# Altium schematic sheet Controller.SchDoc: Controller
size A3; Date: 11.10.2015; DocumentNumber: 2; Revision: 11; SheetNumber: 2; SheetTotal: 5
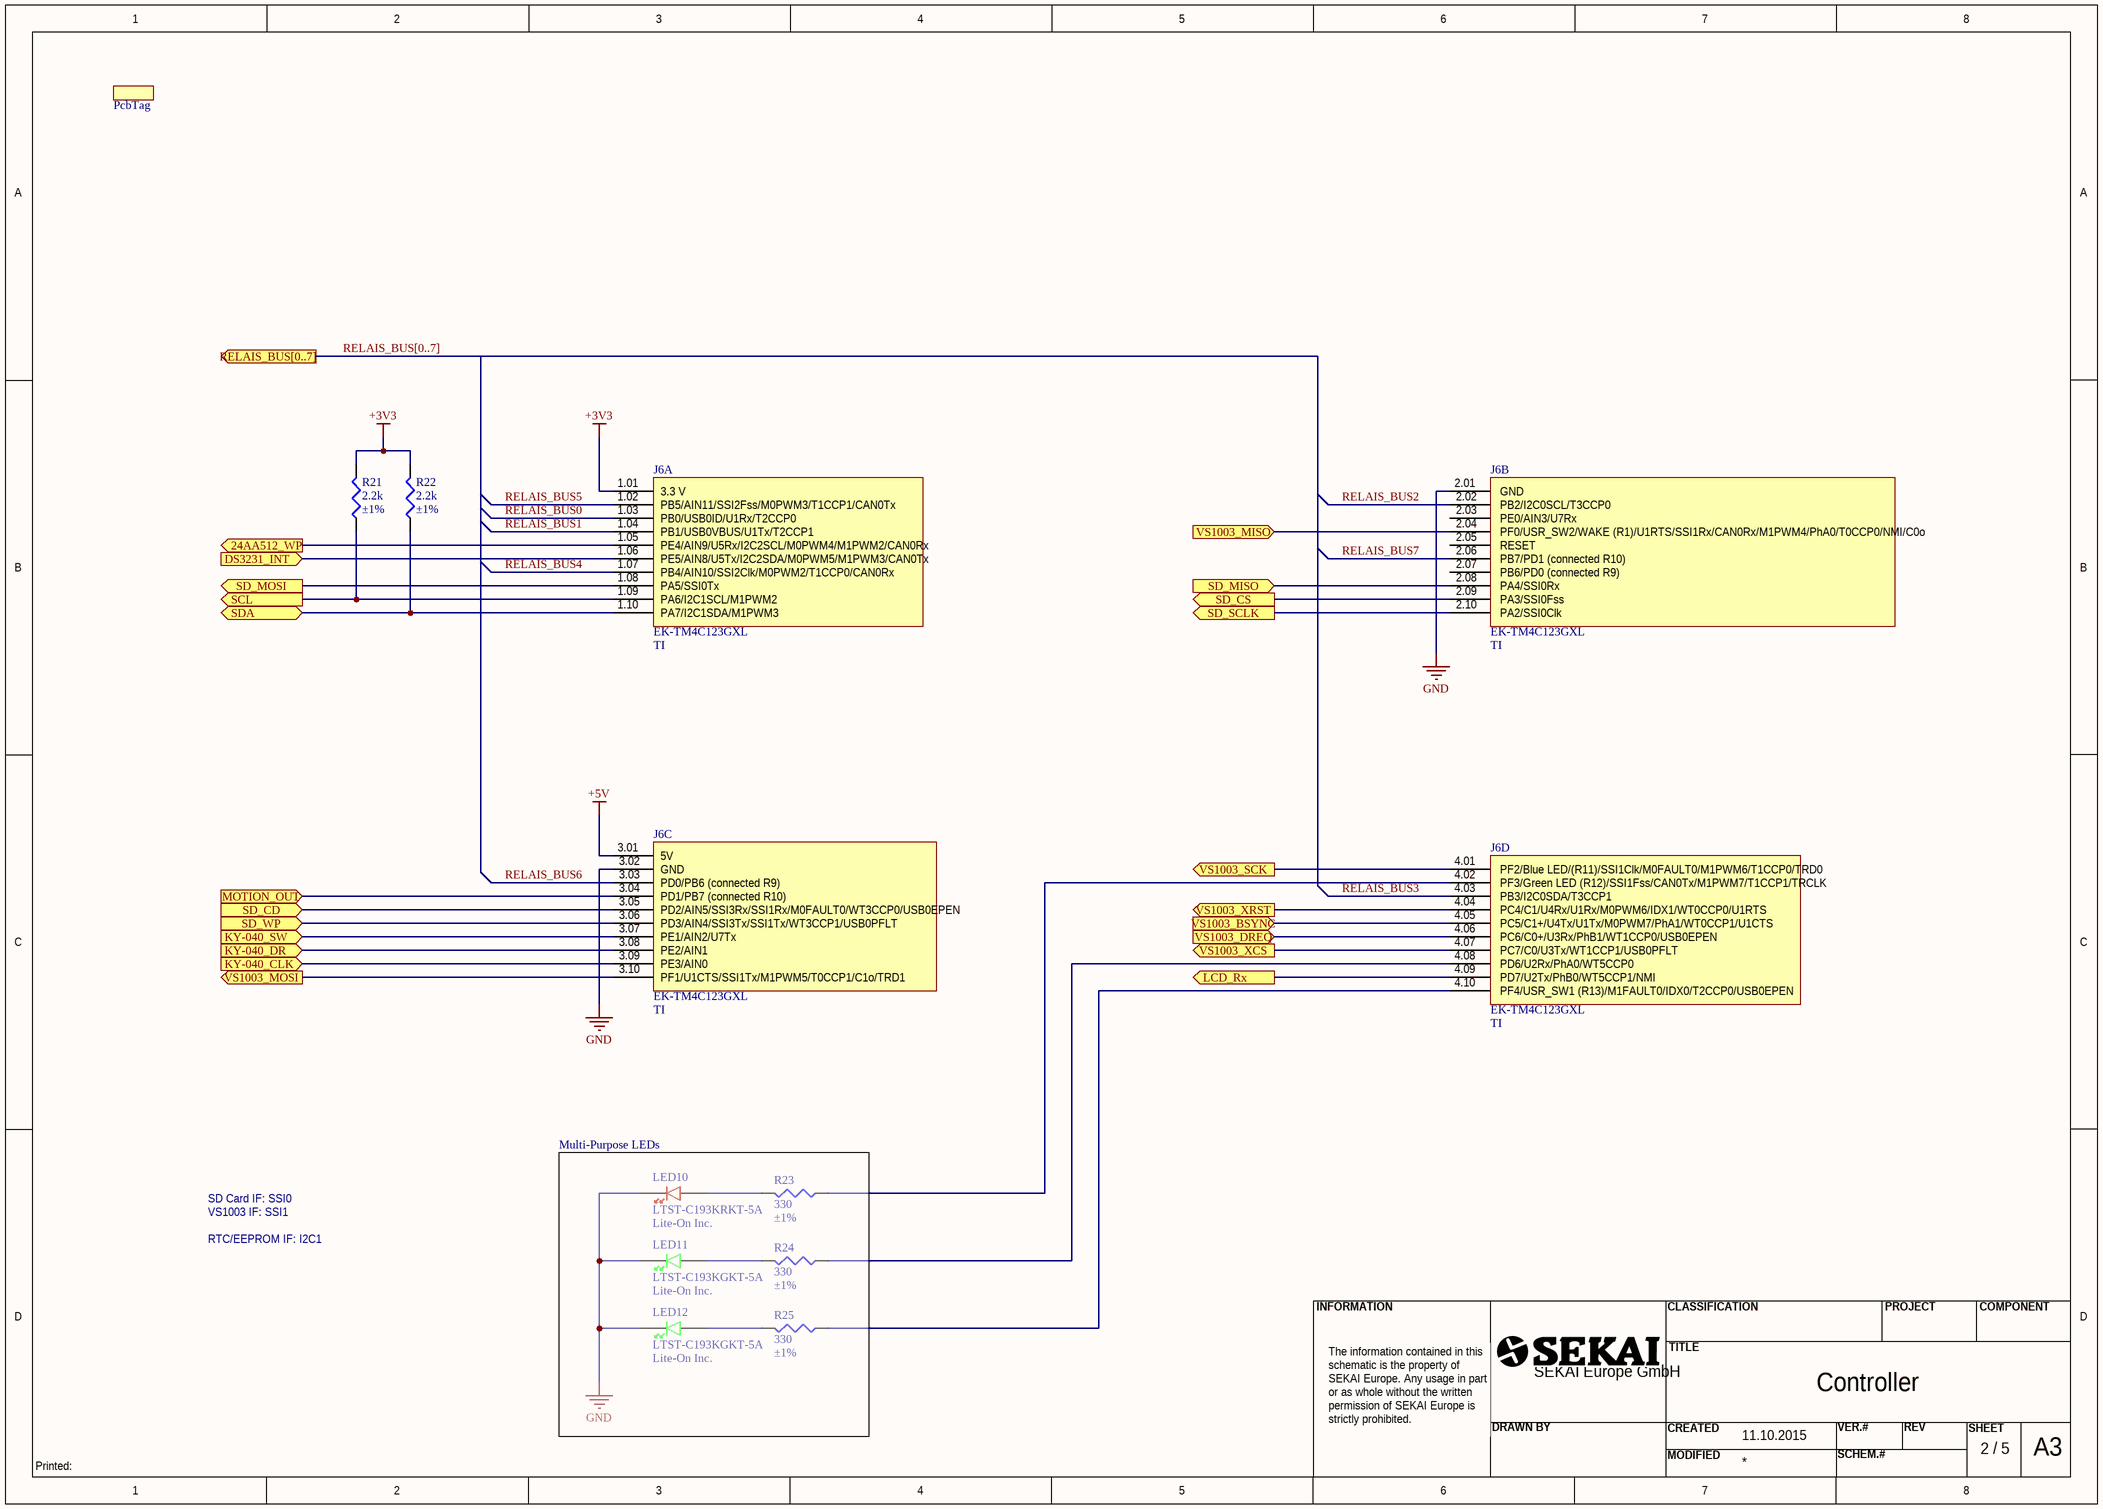
[diagram p0: Controller.SchDoc]

## Parts
?  PcbTag  [PcbTag]
J6  EK-TM4C123GXL  Manufacturer: TI  [EK-TM4C123GXL]  (parts A,B,C,D of 4)
LED10  LTST-C193KRKT-5A  Manufacturer: Lite-On Inc.  [LED0603-RED]
LED11  LTST-C193KGKT-5A  Manufacturer: Lite-On Inc.  [LED0603-GREEN]
LED12  LTST-C193KGKT-5A  Manufacturer: Lite-On Inc.  [LED0603-GREEN]
R21  Resistance (Ohms): 2.2k  Tolerance: ±1%  [R0603]  (hidden comment: ERJ-3EKF2201V)
R22  Resistance (Ohms): 2.2k  Tolerance: ±1%  [R0603]  (hidden comment: ERJ-3EKF2201V)
R23  Resistance (Ohms): 330  Tolerance: ±1%  [R0603]  (hidden comment: ERJ-3EKF3300V)
R24  Resistance (Ohms): 330  Tolerance: ±1%  [R0603]  (hidden comment: ERJ-3EKF3300V)
R25  Resistance (Ohms): 330  Tolerance: ±1%  [R0603]  (hidden comment: ERJ-3EKF3300V)

## Blocks framed on the sheet
Multi-Purpose LEDs: LED10-LED12 R23-R25

## Ports
24AA512_WP (out), DS3231_INT (in), KY-040_CLK (in), KY-040_DR (in), KY-040_SW (in), LCD_Rx (out), MOTION_OUT (in), RELAIS_BUS[0..7] (out), SCL (out), SD_CD (in), SD_CS (out), SD_MISO (in), SD_MOSI (out), SD_SCLK (out), SD_WP (in), SDA (bidir), VS1003_BSYNC (in), VS1003_DREQ (in), VS1003_MISO (in), VS1003_MOSI (out), VS1003_SCK (out), VS1003_XCS (out), VS1003_XRST (out)

## Nets
+3V3: J6.1.01(3.3_V) R21.2 R22.2
+5V: J6.3.01(5V)
GND: J6.2.01(GND) J6.3.02(GND) LED10.2(CATHODE) LED11.2(CATHODE) LED12.2(CATHODE)
24AA512_WP: J6.1.05(PE4/AIN9/U5Rx/I2C2SCL/M0PWM4/M1PWM2/CAN0Rx) ; port 24AA512_WP
DS3231_INT: J6.1.06(PE5/AIN8/U5Tx/I2C2SDA/M0PWM5/M1PWM3/CAN0Tx) ; port DS3231_INT
KY-040_CLK: J6.3.09(PE3/AIN0) ; port KY-040_CLK
KY-040_DR: J6.3.08(PE2/AIN1) ; port KY-040_DR
KY-040_SW: J6.3.07(PE1/AIN2/U7Tx) ; port KY-040_SW
LCD_Rx: J6.4.09(PD7/U2Tx/PhB0/WT5CCP1/NMI) ; port LCD_Rx
MOTION_OUT: J6.3.04(PD1/PB7_(connected_R10)) ; port MOTION_OUT
RELAIS_BUS0: J6.1.03(PB0/USB0ID/U1Rx/T2CCP0)
RELAIS_BUS1: J6.1.04(PB1/USB0VBUS/U1Tx/T2CCP1)
RELAIS_BUS2: J6.2.02(PB2/I2C0SCL/T3CCP0)
RELAIS_BUS3: J6.4.03(PB3/I2C0SDA/T3CCP1)
RELAIS_BUS4: J6.1.07(PB4/AIN10/SSI2Clk/M0PWM2/T1CCP0/CAN0Rx)
RELAIS_BUS5: J6.1.02(PB5/AIN11/SSI2Fss/M0PWM3/T1CCP1/CAN0Tx)
RELAIS_BUS6: J6.3.03(PD0/PB6_(connected_R9))
RELAIS_BUS7: J6.2.06(PB7/PD1_(connected_R10))
SCL: J6.1.09(PA6/I2C1SCL/M1PWM2) R21.1 ; port SCL
SD_CD: J6.3.05(PD2/AIN5/SSI3Rx/SSI1Rx/M0FAULT0/WT3CCP0/USB0EPEN) ; port SD_CD
SD_CS: J6.2.09(PA3/SSI0Fss) ; port SD_CS
SD_MISO: J6.2.08(PA4/SSI0Rx) ; port SD_MISO
SD_MOSI: J6.1.08(PA5/SSI0Tx) ; port SD_MOSI
SD_SCLK: J6.2.10(PA2/SSI0Clk) ; port SD_SCLK
SD_WP: J6.3.06(PD3/AIN4/SSI3Tx/SSI1Tx/WT3CCP1/USB0PFLT) ; port SD_WP
SDA: J6.1.10(PA7/I2C1SDA/M1PWM3) R22.1 ; port SDA
VS1003_BSYNC: J6.4.05(PC5/C1+/U4Tx/U1Tx/M0PWM7/PhA1/WT0CCP1/U1CTS) ; port VS1003_BSYNC
VS1003_DREQ: J6.4.06(PC6/C0+/U3Rx/PhB1/WT1CCP0/USB0EPEN) ; port VS1003_DREQ
VS1003_MISO: J6.2.04(PF0/USR_SW2/WAKE_(R1)/U1RTS/SSI1Rx/CAN0Rx/M1PWM4/PhA0/T0CCP0/NMI/C0o) ; port VS1003_MISO
VS1003_MOSI: J6.3.10(PF1/U1CTS/SSI1Tx/M1PWM5/T0CCP1/C1o/TRD1) ; port VS1003_MOSI
VS1003_SCK: J6.4.01(PF2/Blue_LED/(R11)/SSI1Clk/M0FAULT0/M1PWM6/T1CCP0/TRD0) ; port VS1003_SCK
VS1003_XCS: J6.4.07(PC7/C0/U3Tx/WT1CCP1/USB0PFLT) ; port VS1003_XCS
VS1003_XRST: J6.4.04(PC4/C1/U4Rx/U1Rx/M0PWM6/IDX1/WT0CCP0/U1RTS) ; port VS1003_XRST
NetJ6_4.02: J6.4.02(PF3/Green_LED_(R12)/SSI1Fss/CAN0Tx/M1PWM7/T1CCP1/TRCLK) R23.1
NetJ6_4.08: J6.4.08(PD6/U2Rx/PhA0/WT5CCP0) R24.1
NetJ6_4.10: J6.4.10(PF4/USR_SW1_(R13)/M1FAULT0/IDX0/T2CCP0/USB0EPEN) R25.1
NetLED10_1: LED10.1(ANODE) R23.2
NetLED11_1: LED11.1(ANODE) R24.2
NetLED12_1: LED12.1(ANODE) R25.2

Not connected (* = marked no-connect by the designer): J6 2.03(PE0/AIN3/U7Rx) 2.05(RESET) 2.07(PB6/PD0_(connected_R9))

## Buses and harness runs
bus RELAIS_BUS[0..7] = port RELAIS_BUS[0..7]

## Notes on the sheet
- VS1003 IF: SSI1
- SD Card IF: SSI0
- RTC/EEPROM IF: I2C1
- INFORMATION
- CLASSIFICATION
- PROJECT
- COMPONENT
- SEKAI Europe GmbH
- TITLE
- The information contained in this schematic is the property of SEKAI Europe. Any usage in part or as whole without the written permission of SEKAI Europe is strictly prohibited.
- DRAWN BY
- CREATED
- MODIFIED
- VER.#
- SCHEM.#
- REV
- SHEET
- A3
- Printed:

## Library data of the parts
J6 = EK-TM4C123GXL: EVAL KIT TM4C123GXL LAUNCHPAD; Board Type: Evaluation Platform; Core Processor: ARM® Cortex®-M4F; Platform: LaunchPad™; Contents: Board(s), Cable(s); Supplier 1: Digi-Key; Manufacturer Part Number: EK-TM4C123GXL; RoHS: RoHS Compliant By Exemption; Category: Programmers, Development Systems; Stock 1: 1173; Pricing 1: 1=12.03 (EUR); Type: MCU 32-Bit; Operating System: -; For Use With/Related Products: TM4C123G; Mounting Type: Fixed; ComponentLink1URL: http://www.ti.com/lit/pdf/spmu296; ComponentLink1Description: http://www.ti.com/lit/pdf/spmu296; Supplier Part Number 1: 296-35760-ND
LED10 = LTST-C193KRKT-5A: LED RED CLEAR 0603 SMD; Wavelength - Dominant: 631nm; Wavelength - Peak: 639nm; Millicandela Rating: 26.05mcd; Voltage - Forward (Vf) (Typ): 2V; Current - Test: 5mA; Viewing Angle: 130°; Lens Color: Colorless; Lens Style/Size: Rectangle with Flat Top, 1.15mm x 0.80mm; Supplier 1: Digi-Key; Manufacturer Part Number: LTST-C193KRKT-5A; RoHS: RoHS Compliant; Category: Optoelectronics; Stock 1: 115770; Pricing 1: 1=0.38, 10=0.276, 100=0.1461, 250=0.10336, 500=0.0882, 1000=0.0689 (EUR); Packaging: Cut Tape (CT); Color: Red; Lens Transparency: Clear; Package / Case: 0603 (1608 Metric); Supplier Device Package: *; Size / Dimension: 1.60mm L x 0.80mm W; Height (Max): 0.35mm; Mounting Type: Surface Mount; ComponentLink1URL: http://optoelectronics.liteon.com/upload/download/DS22-2005-077/S_110_LTST-C193KRKT-5A.pdf; ComponentLink1Description: http://optoelectronics.liteon.com/upload/download/DS22-2005-077/S_110_LTST-C193KRKT-5A.pdf; Supplier Part Number 1: 160-1830-1-ND
LED11 LED12 = LTST-C193KGKT-5A: LED GREEN CLEAR 0603 SMD; Wavelength - Dominant: 572nm; Wavelength - Peak: 574nm; Millicandela Rating: 16.25mcd; Voltage - Forward (Vf) (Typ): 2V; Current - Test: 5mA; Viewing Angle: 130°; Lens Color: Colorless; Lens Style/Size: Rectangle with Flat Top, 1.15mm x 0.80mm; Supplier 1: Digi-Key; Manufacturer Part Number: LTST-C193KGKT-5A; RoHS: RoHS Compliant; Category: Optoelectronics; Stock 1: 64103; Pricing 1: 1=0.38, 10=0.276, 100=0.1461, 250=0.10336, 500=0.0882, 1000=0.0689 (EUR); Packaging: Digi-Reel®; Color: Green; Lens Transparency: Clear; Package / Case: 0603 (1608 Metric); Supplier Device Package: *; Size / Dimension: 1.60mm L x 0.80mm W; Height (Max): 0.35mm; Mounting Type: Surface Mount; ComponentLink1URL: http://optoelectronics.liteon.com/upload/download/DS22-2007-0094/S_110_LTST-C193KGKT-5A.pdf; ComponentLink1Description: http://optoelectronics.liteon.com/upload/download/DS22-2007-0094/S_110_LTST-C193KGKT-5A.pdf; Supplier Part Number 1: 160-1828-6-ND
R21 R22 = ERJ-3EKF2201V: RES SMD 2.2K OHM 1% 1/10W 0603; Manufacturer: Panasonic Electronic Components; Power (Watts): 0.1W, 1/10W; Temperature Coefficient: ±100ppm/°C; Supplier 1: Digi-Key; Manufacturer Part Number: ERJ-3EKF2201V; RoHS: RoHS Compliant; Category: Resistors; Stock 1: 517387; Pricing 1: 1=0.1, 50=0.0154, 100=0.0117, 250=0.00864, 500=0.00638, 1000=0.00426, 2500=0.0036 (EUR); Packaging: Cut Tape (CT); Composition: Thick Film; Features: Automotive AEC-Q200; Operating Temperature: -55°C ~ 155°C; Package / Case: 0603 (1608 Metric); Supplier Device Package: 0603; Size / Dimension: 0.063" L x 0.031" W (1.60mm x 0.80mm); Height: 0.022" (0.55mm); Number of Terminations: 2; ComponentLink1URL: http://industrial.panasonic.com/www-cgi/jvcr13pz.cgi?E+PZ+3+AOA0002+ERJ3EKF2201V+7+WW; ComponentLink1Description: http://industrial.panasonic.com/www-cgi/jvcr13pz.cgi?E+PZ+3+AOA0002+ERJ3EKF2201V+7+WW; Supplier Part Number 1: P2.20KHCT-ND
R23-R25 = ERJ-3EKF3300V: RES SMD 330 OHM 1% 1/10W 0603; Manufacturer: Panasonic Electronic Components; Power (Watts): 0.1W, 1/10W; Temperature Coefficient: ±100ppm/°C; Supplier 1: Digi-Key; Manufacturer Part Number: ERJ-3EKF3300V; RoHS: RoHS Compliant; Category: Resistors; Stock 1: 360334; Pricing 1: 1=0.1, 50=0.0154, 100=0.0117, 250=0.00864, 500=0.00638, 1000=0.00426, 2500=0.0036 (EUR); Packaging: Cut Tape (CT); Composition: Thick Film; Features: Automotive AEC-Q200; Operating Temperature: -55°C ~ 155°C; Package / Case: 0603 (1608 Metric); Supplier Device Package: 0603; Size / Dimension: 0.063" L x 0.031" W (1.60mm x 0.80mm); Height: 0.022" (0.55mm); Number of Terminations: 2; ComponentLink1URL: http://industrial.panasonic.com/www-cgi/jvcr13pz.cgi?E+PZ+3+AOA0002+ERJ3EKF3300V+7+WW; ComponentLink1Description: http://industrial.panasonic.com/www-cgi/jvcr13pz.cgi?E+PZ+3+AOA0002+ERJ3EKF3300V+7+WW; Supplier Part Number 1: P330HCT-ND